# EAGLE design OpenBook (EAGLE 9.7.0)
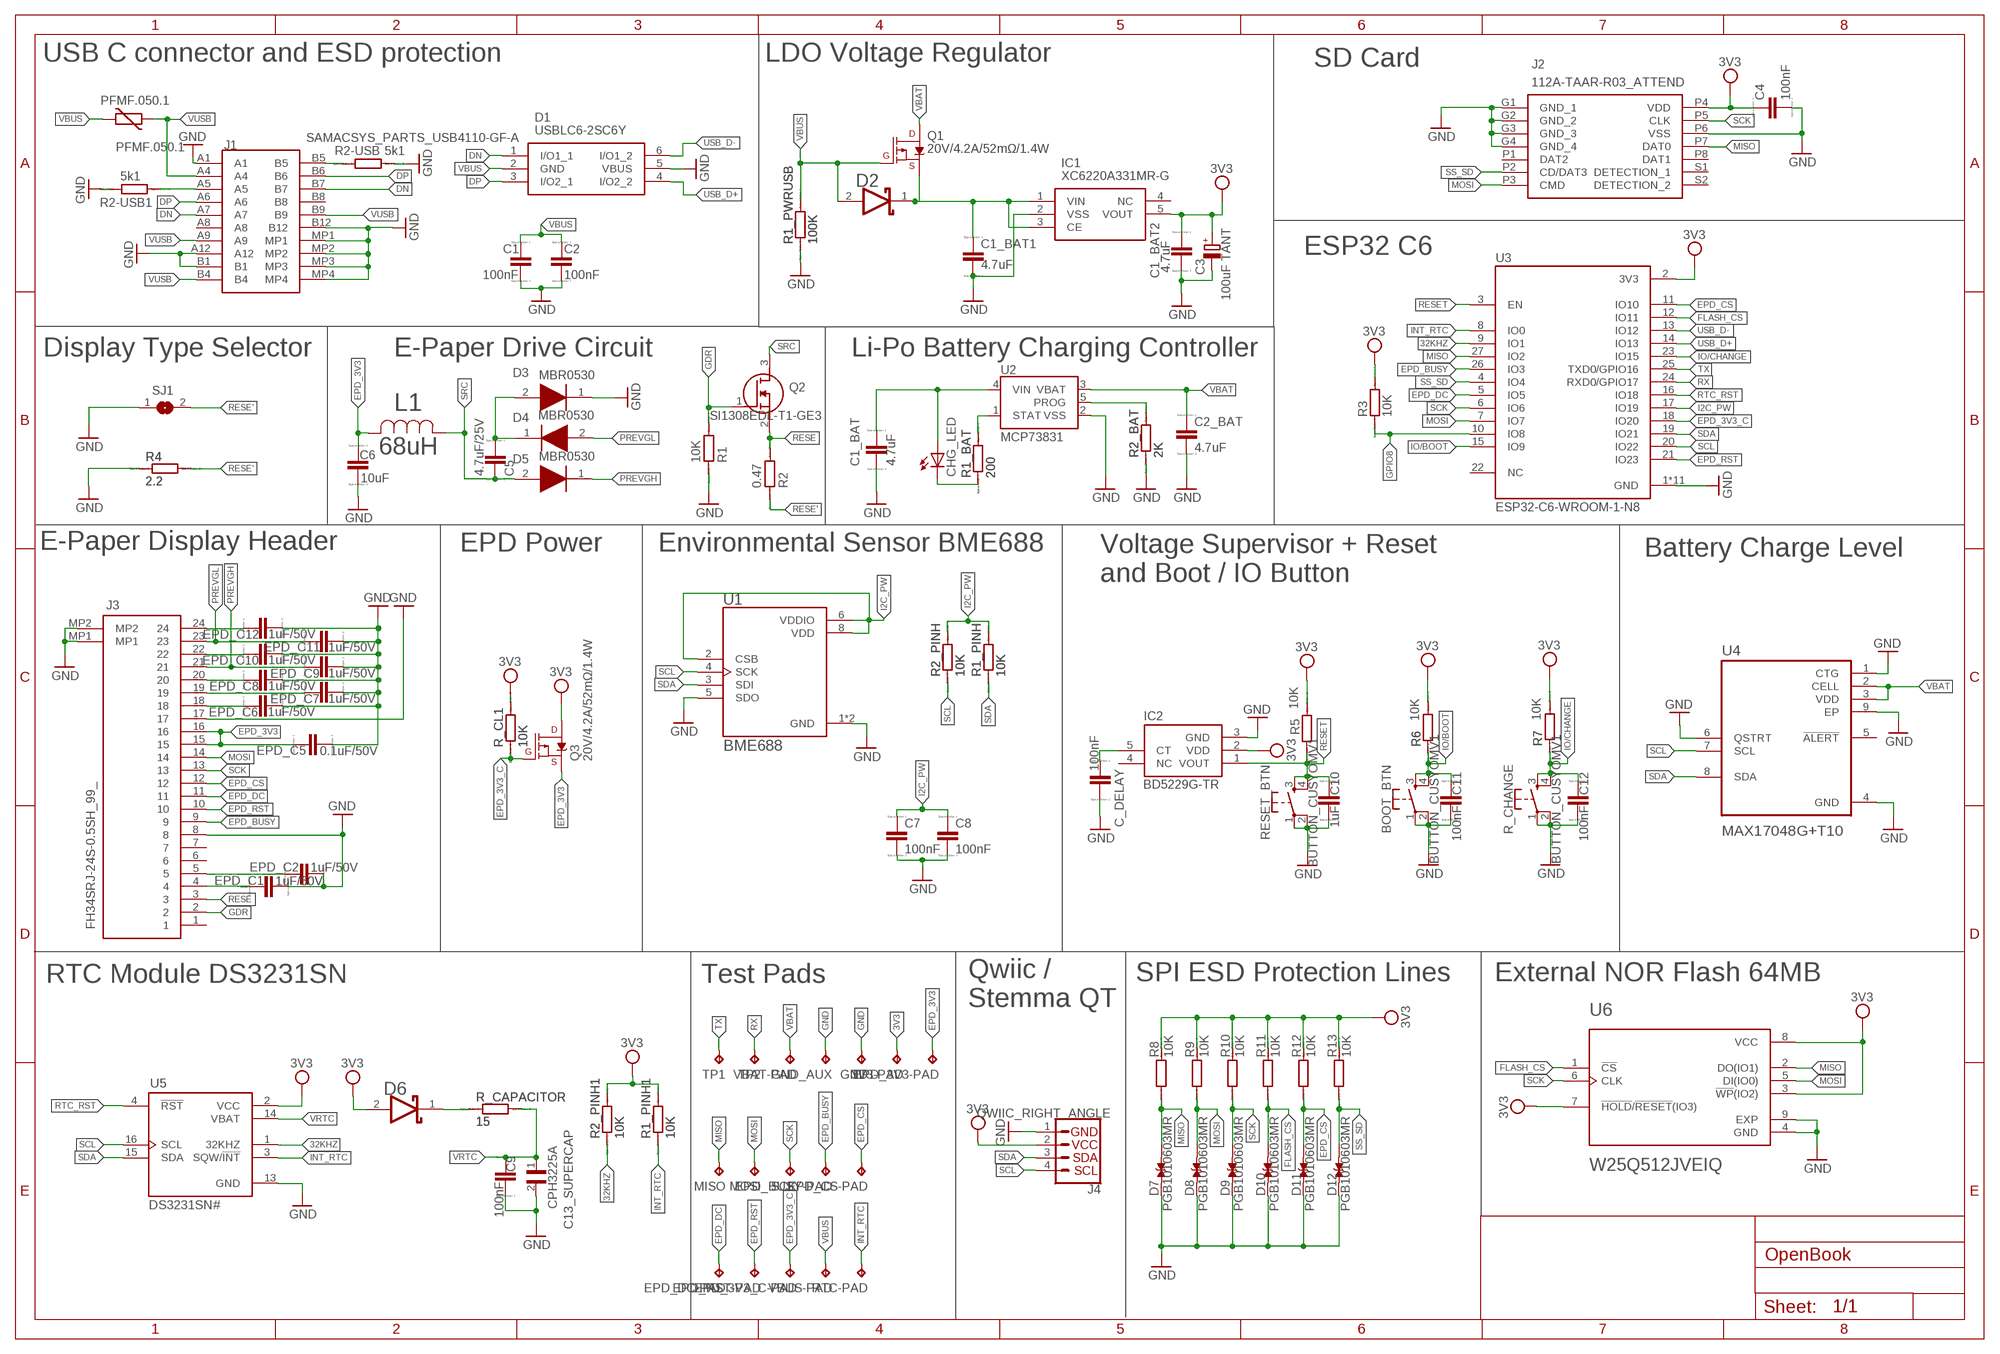
[diagram p0: schematic, sheet 1]

## Parts
3V3-PAD  TPTP20R  [TP20R]
BOOT_BTN  BUTTON_CUSYOMV1  [MYBUTTON]
C1  100nF  ESP32_WROVER_EAGLE-LTSPICE_CC0402  [ESP32_WROVER_EAGLE-LTSPICE_C0402]
C1_BAT  4.7uF  EAGLE-LTSPICE_CC0402  [EAGLE-LTSPICE_C0402]
C1_BAT1  4.7uF  EAGLE-LTSPICE_CC0402  [EAGLE-LTSPICE_C0402]
C1_BAT2  4.7uF  EAGLE-LTSPICE_CC0402  [EAGLE-LTSPICE_C0402]
C2  100nF  ESP32_WROVER_EAGLE-LTSPICE_CC0402  [ESP32_WROVER_EAGLE-LTSPICE_C0402]
C2_BAT  4.7uF  EAGLE-LTSPICE_CC0402  [EAGLE-LTSPICE_C0402]
C3  100uF TANT  RCL_CPOL-EUCT3528  [RCL_CT3528]
C4  100nF  EAGLE-LTSPICE_CC0402  [EAGLE-LTSPICE_C0402]
C5  4.7uF/25V  ESP32_WROVER_EAGLE-LTSPICE_CC0402  [ESP32_WROVER_EAGLE-LTSPICE_C0402]
C6  10uF  ESP32_WROVER_EAGLE-LTSPICE_CC0402  [ESP32_WROVER_EAGLE-LTSPICE_C0402]
C7  100nF  EAGLE-LTSPICE_CC0402  [EAGLE-LTSPICE_C0402]
C8  100nF  EAGLE-LTSPICE_CC0402  [EAGLE-LTSPICE_C0402]
C9  100nF  EAGLE-LTSPICE_CC0402  [EAGLE-LTSPICE_C0402]
C10  1uF  EAGLE-LTSPICE_CC0402  [EAGLE-LTSPICE_C0402]
C11  100nF  EAGLE-LTSPICE_CC0402  [EAGLE-LTSPICE_C0402]
C12  100nF  EAGLE-LTSPICE_CC0402  [EAGLE-LTSPICE_C0402]
C13_SUPERCAP  CPH3225A  [CAPCP3225X100N]
C_DELAY  100nF  EAGLE-LTSPICE_CC0402  [EAGLE-LTSPICE_C0402]
CHG_LED  ADAFRUIT_LEDCHIP-LED0603  [ADAFRUIT_CHIP-LED0603]
D1  USBLC6-2SC6Y  [SOT95P280X145-6N]
D2  ESP32_WROVER_AVX---SD0805S020S1R0_AVX_SD0805S020S1R0_0_0AVX_SD0805S020S1R0_0_0  [ESP32_WROVER_AVX---SD0805S020S1R0_AVX_SD0805S020S1R0_0]
D3  MBR0530  [SOD3716X135N]
D4  MBR0530  [SOD3716X135N]
D5  MBR0530  [SOD3716X135N]
D6  ESP32_WROVER_AVX---SD0805S020S1R0_AVX_SD0805S020S1R0_0_0AVX_SD0805S020S1R0_0_0  [ESP32_WROVER_AVX---SD0805S020S1R0_AVX_SD0805S020S1R0_0]
D7  PGB1010603MR  [DIOC1608X36N]
D8  PGB1010603MR  [DIOC1608X36N]
D9  PGB1010603MR  [DIOC1608X36N]
D10  PGB1010603MR  [DIOC1608X36N]
D11  PGB1010603MR  [DIOC1608X36N]
D12  PGB1010603MR  [DIOC1608X36N]
EPD_3V3-PAD  TPTP20R  [TP20R]
EPD_3V3_C-PAD  TPTP20R  [TP20R]
EPD_BUSY-PAD  TPTP20R  [TP20R]
EPD_C1  1uF/50V  ESP32_WROVER_EAGLE-LTSPICE_CC0402  [ESP32_WROVER_EAGLE-LTSPICE_C0402]
EPD_C2  1uF/50V  ESP32_WROVER_EAGLE-LTSPICE_CC0402  [ESP32_WROVER_EAGLE-LTSPICE_C0402]
EPD_C5  0.1uF/50V  ESP32_WROVER_EAGLE-LTSPICE_CC0402  [ESP32_WROVER_EAGLE-LTSPICE_C0402]
EPD_C6  1uF/50V  ESP32_WROVER_EAGLE-LTSPICE_CC0402  [ESP32_WROVER_EAGLE-LTSPICE_C0402]
EPD_C7  1uF/50V  ESP32_WROVER_EAGLE-LTSPICE_CC0402  [ESP32_WROVER_EAGLE-LTSPICE_C0402]
EPD_C8  1uF/50V  ESP32_WROVER_EAGLE-LTSPICE_CC0402  [ESP32_WROVER_EAGLE-LTSPICE_C0402]
EPD_C9  1uF/50V  ESP32_WROVER_EAGLE-LTSPICE_CC0402  [ESP32_WROVER_EAGLE-LTSPICE_C0402]
EPD_C10  1uF/50V  ESP32_WROVER_EAGLE-LTSPICE_CC0402  [ESP32_WROVER_EAGLE-LTSPICE_C0402]
EPD_C11  1uF/50V  ESP32_WROVER_EAGLE-LTSPICE_CC0402  [ESP32_WROVER_EAGLE-LTSPICE_C0402]
EPD_C12  1uF/50V  ESP32_WROVER_EAGLE-LTSPICE_CC0402  [ESP32_WROVER_EAGLE-LTSPICE_C0402]
EPD_CS-PAD  TPTP20R  [TP20R]
EPD_DC-PAD  TPTP20R  [TP20R]
EPD_RST-PAD  TPTP20R  [TP20R]
GND  TPTP20R  [TP20R]
GND_AUX  TPTP20R  [TP20R]
IC1  XC6220A331MR-G  [SOT95P280X120-5N]
IC2  BD5229G-TR  [SOT95P280X125-5N]
J1  SAMACSYS_PARTS_USB4110-GF-A  [SAMACSYS_PARTS_USB4110GFA]
J2  112A-TAAR-R03_ATTEND  [112ATAARR03ATTEND]
J3  FH34SRJ-24S-0.5SH_99_  [FH34SRJ24S05SH99]
J4  QWIIC_RIGHT_ANGLE  QWIIC_CONNECTORJS-1MM  [JST04_1MM_RA]
L1  68uH  744043680IND_4828-WE-TPC_WRE  [IND_4828-WE-TPC_WRE]
MISO  TPTP20R  [TP20R]
MOSI  TPTP20R  [TP20R]
PFMF.050.1  PFMF.050.1  ESP32C6_VARISTORCN1812  [ESP32C6_VARISTOR_CT/CN1812]
Q1  20V/4.2A/52mΩ/1.4W  ESP32_WROVER_SPARKFUN-DISCRETESEMI_MOSFET_PCH-DMG2305UX-7  [ESP32_WROVER_SPARKFUN-DISCRETESEMI_SOT23-3]
Q2  SI1308EDL-T1-GE3  [SOT65P210X110-3N]
Q3  20V/4.2A/52mΩ/1.4W  ESP32_WROVER_SPARKFUN-DISCRETESEMI_MOSFET_PCH-DMG2305UX-7  [ESP32_WROVER_SPARKFUN-DISCRETESEMI_SOT23-3]
R1  10K  ESP32_WROVER_EAGLE-LTSPICE_RR0402  [ESP32_WROVER_EAGLE-LTSPICE_R0402]
R1_BAT  200  ESP32_WROVER_EAGLE-LTSPICE_RR0402  [ESP32_WROVER_EAGLE-LTSPICE_R0402]
R1_PINH  10K  ESP32_WROVER_EAGLE-LTSPICE_RR0402  [ESP32_WROVER_EAGLE-LTSPICE_R0402]
R1_PINH1  10K  ESP32_WROVER_EAGLE-LTSPICE_RR0402  [ESP32_WROVER_EAGLE-LTSPICE_R0402]
R1_PWRUSB  100K  ESP32_WROVER_EAGLE-LTSPICE_RR0402  [ESP32_WROVER_EAGLE-LTSPICE_R0402]
R2  0.47  ESP32_WROVER_EAGLE-LTSPICE_RR0402  [ESP32_WROVER_EAGLE-LTSPICE_R0402]
R2-USB  5k1  ESP32_WROVER_EAGLE-LTSPICE_RR0402  [ESP32_WROVER_EAGLE-LTSPICE_R0402]
R2-USB1  5k1  ESP32_WROVER_EAGLE-LTSPICE_RR0402  [ESP32_WROVER_EAGLE-LTSPICE_R0402]
R2_BAT  2K  ESP32_WROVER_EAGLE-LTSPICE_RR0402  [ESP32_WROVER_EAGLE-LTSPICE_R0402]
R2_PINH  10K  ESP32_WROVER_EAGLE-LTSPICE_RR0402  [ESP32_WROVER_EAGLE-LTSPICE_R0402]
R2_PINH1  10K  ESP32_WROVER_EAGLE-LTSPICE_RR0402  [ESP32_WROVER_EAGLE-LTSPICE_R0402]
R3  10K  ESP32_WROVER_EAGLE-LTSPICE_RR0402  [ESP32_WROVER_EAGLE-LTSPICE_R0402]
R4  2.2  ESP32_WROVER_EAGLE-LTSPICE_RR0402  [ESP32_WROVER_EAGLE-LTSPICE_R0402]
R5  10K  ESP32_WROVER_EAGLE-LTSPICE_RR0402  [ESP32_WROVER_EAGLE-LTSPICE_R0402]
R6  10K  ESP32_WROVER_EAGLE-LTSPICE_RR0402  [ESP32_WROVER_EAGLE-LTSPICE_R0402]
R7  10K  ESP32_WROVER_EAGLE-LTSPICE_RR0402  [ESP32_WROVER_EAGLE-LTSPICE_R0402]
R8  10K  ESP32_WROVER_EAGLE-LTSPICE_RR0402  [ESP32_WROVER_EAGLE-LTSPICE_R0402]
R9  10K  ESP32_WROVER_EAGLE-LTSPICE_RR0402  [ESP32_WROVER_EAGLE-LTSPICE_R0402]
R10  10K  ESP32_WROVER_EAGLE-LTSPICE_RR0402  [ESP32_WROVER_EAGLE-LTSPICE_R0402]
R11  10K  ESP32_WROVER_EAGLE-LTSPICE_RR0402  [ESP32_WROVER_EAGLE-LTSPICE_R0402]
R12  10K  ESP32_WROVER_EAGLE-LTSPICE_RR0402  [ESP32_WROVER_EAGLE-LTSPICE_R0402]
R13  10K  ESP32_WROVER_EAGLE-LTSPICE_RR0402  [ESP32_WROVER_EAGLE-LTSPICE_R0402]
R_CAPACITOR  15  ESP32_WROVER_EAGLE-LTSPICE_RR0402  [ESP32_WROVER_EAGLE-LTSPICE_R0402]
R_CHANGE  BUTTON_CUSYOMV1  [MYBUTTON]
R_CL1  10K  ESP32_WROVER_EAGLE-LTSPICE_RR0402  [ESP32_WROVER_EAGLE-LTSPICE_R0402]
RESET_BTN  BUTTON_CUSYOMV1  [MYBUTTON]
RTC-PAD  TPTP20R  [TP20R]
SCK  TPTP20R  [TP20R]
SJ1  SJ  [SJ]
TP1  TPTP20R  [TP20R]
TP2  TPTP20R  [TP20R]
U1  BME688  ESP32_WROVER_BME680_BME680  [ESP32_WROVER_BME680_PSON80P300X300X100-8N]
U2  MCP73831  ESP32_WROVER_SPARKFUN-IC-POWER_MCP73831  [ESP32_WROVER_SPARKFUN-IC-POWER_SOT23-5]
U3  ESP32-C6-WROOM-1-N8  [XCVR_ESP32-C6-WROOM-1-N8]
U4  MAX17048G+T10  [SON50P200X200X80-9N]
U5  DS3231SN#  [SOIC127P1032X265-16N]
U6  W25Q512JVEIQ  [SON127P600X800X80-9N]
VBAT-PAD  TPTP20R  [TP20R]
VBUS-PAD  TPTP20R  [TP20R]

## Nets
3V3: 3V3-PAD.TP C1_BAT2.1 C3.+ C4.1 D6.2(ANODE) IC1.5(VOUT) IC2.2(VDD) J2.P4(VDD) J4.2 Q3.3(D) R1_PINH1.2 R2_PINH1.2 R3.2 R5.2 R6.2 R7.2 R8.2 R9.2 R10.2 R11.2 R12.2 R13.2 R_CL1.2 U3.2(3V3) U5.2(VCC) U6.3(!WP!(IO2)) U6.7(!HOLD!/!RESET!(IO3)) U6.8(VCC)
32KHZ: R2_PINH1.1 U3.9(IO1) U5.1(32KHZ)
DN: D1.1(I/O1_1) J1.A7 J1.B7
DP: D1.3(I/O2_1) J1.A6 J1.B6
EPD_3V3: C6.1 EPD_3V3-PAD.TP EPD_C5.1 J3.15 J3.16 L1.2 Q3.2(S)
EPD_3V3_C: EPD_3V3_C-PAD.TP Q3.1(G) R_CL1.1 U3.18(IO20)
EPD_BUSY: EPD_BUSY-PAD.TP J3.9 U3.26(IO3)
EPD_CS: D11.2 EPD_CS-PAD.TP J3.12 R12.1 U3.11(IO10)
EPD_DC: EPD_DC-PAD.TP J3.11 U3.5(IO5)
EPD_RST: EPD_RST-PAD.TP J3.10 U3.21(IO23)
FLASH_CS: D10.2 R11.1 U3.12(IO11) U6.1(!CS)
GDR: J3.2 Q2.1(G) R1.2
GND: BOOT_BTN.1 BOOT_BTN.2 C1.2 C1_BAT1.2 C1_BAT2.2 C1_BAT.2 C2.2 C2_BAT.2 C3.- C4.2 C6.2 C7.2 C8.2 C9.2 C10.2 C11.2 C12.2 C13_SUPERCAP.2 C_DELAY.2 D1.5(VBUS) D3.1(K) D7.1 D8.1 D9.1 D10.1 D11.1 D12.1 EPD_C1.1 EPD_C2.1 EPD_C5.2 EPD_C6.2 EPD_C7.2 EPD_C8.2 EPD_C9.2 EPD_C10.2 EPD_C11.2 EPD_C12.2 GND.TP GND_AUX.TP IC1.2(VSS) IC2.3(GND) J1.A1 J1.A12 J1.B1 J1.B12 J1.MP1 J1.MP2 J1.MP3 J1.MP4 J2.G1(GND_1) J2.G2(GND_2) J2.G3(GND_3) J2.G4(GND_4) J2.P6(VSS) J3.8 J3.17 J3.MP1 J3.MP2 J4.1 R1.1 R1_PWRUSB.1 R2-USB1.1 R2-USB.2 R2_BAT.1 R4.1 R_CHANGE.1 R_CHANGE.2 RESET_BTN.1 RESET_BTN.2 SJ1.1 U1.1(GND) U1.5(SDO) U1.7(GND) U2.2(VSS) U3.1(GND) U3.28(GND) U3.29_1(GND) U3.29_2(GND) U3.29_3(GND) U3.29_4(GND) U3.29_5(GND) U3.29_6(GND) U3.29_7(GND) U3.29_8(GND) U3.29_9(GND) U4.1(CTG) U4.4(GND) U4.6(QSTRT) U4.9(EP) U5.13(GND) U6.4(GND) U6.9(EXP)
GPIO8: R3.1 U3.10(IO8)
I2C_PW: C7.1 C8.1 R1_PINH.2 R2_PINH.2 U1.2(CSB) U1.6(VDDIO) U1.8(VDD) U3.17(IO19)
INT_RTC: R1_PINH1.1 RTC-PAD.TP U3.8(IO0) U5.3(SQW/!INT)
IO/BOOT: BOOT_BTN.3 BOOT_BTN.4 C11.1 R6.1 U3.15(IO9)
IO/CHANGE: C12.1 R7.1 R_CHANGE.3 R_CHANGE.4 U3.23(IO15)
MISO: D7.2 J2.P7(DAT0) MISO.TP R8.1 U3.27(IO2) U6.2(DO(IO1))
MOSI: D8.2 J2.P3(CMD) J3.14 MOSI.TP R9.1 U3.7(IO7) U6.5(DI(IO0))
N$1: J1.A5 R2-USB1.2
N$2: J1.B5 R2-USB.1
N$3: C1_BAT1.1 D2.1(CATHODE) IC1.1(VIN) IC1.3(CE) Q1.2(S)
N$4: C5.1 D3.2(A) D4.1(K)
N$5: EPD_C1.2 J3.4
N$6: EPD_C2.2 J3.5
N$7: EPD_C6.1 J3.18
N$8: EPD_C7.1 J3.19
N$9: EPD_C8.1 J3.20
N$10: R2_BAT.2 U2.5(PROG)
N$11: EPD_C10.1 J3.22
N$12: R1_BAT.2 U2.1(STAT)
N$13: EPD_C12.1 J3.24
N$14: CHG_LED.C R1_BAT.1
N$15: C1_BAT.1 CHG_LED.A U2.4(VIN)
N$16: C_DELAY.1 IC2.5(CT)
N$17: D6.1(CATHODE) R_CAPACITOR.1
PREVGH: D5.1(K) EPD_C9.1 J3.21
PREVGL: D4.2(A) EPD_C11.1 J3.23
RESE: J3.3 Q2.2(S) R2.2
RESE': R2.1 R4.2 SJ1.2
RESET: C10.1 IC2.1(VOUT) R5.1 RESET_BTN.3 RESET_BTN.4 U3.3(EN)
RTC_RST: U3.16(IO18) U5.4(!RST)
RX: TP2.TP U3.24(RXD0/GPIO17)
SCK: D9.2 J2.P5(CLK) J3.13 R10.1 SCK.TP U3.6(IO6) U6.6(CLK)
SCL: J4.4 R2_PINH.1 U1.4(SCK) U3.20(IO22) U4.7(SCL) U5.16(SCL)
SDA: J4.3 R1_PINH.1 U1.3(SDI) U3.19(IO21) U4.8(SDA) U5.15(SDA)
SRC: C5.2 D5.2(A) L1.1 Q2.3(D)
SS_SD: D12.2 J2.P2(CD/DAT3) R13.1 U3.4(IO4)
TX: TP1.TP U3.25(TXD0/GPIO16)
USB_D+: D1.4(I/O2_2) U3.14(IO13)
USB_D-: D1.6(I/O1_2) U3.13(IO12)
VBAT: C2_BAT.1 Q1.3(D) U2.3(VBAT) U4.2(CELL) U4.3(VDD) VBAT-PAD.TP
VBUS: C1.1 C2.1 D1.2(GND) D2.2(ANODE) PFMF.050.1.2 Q1.1(G) R1_PWRUSB.2 VBUS-PAD.TP
VRTC: C9.1 C13_SUPERCAP.1 R_CAPACITOR.2 U5.14(VBAT)
VUSB: J1.A4 J1.A9 J1.B4 J1.B9 PFMF.050.1.1
Unconnected: IC1.4(NC) IC2.4(NC) J1.A8 J1.B8 J2.P1(DAT2) J2.P8(DAT1) J2.S1(DETECTION_1) J2.S2(DETECTION_2) J3.1 J3.6 J3.7 U3.22(NC) U4.5(!ALERT)

## Notes on the sheet
- USB C connector and ESD protection | LDO Voltage Regulator | SD Card
- ESP32 C6
- Display Type Selector | E-Paper Drive Circuit | Li-Po Battery Charging Controller
- E-Paper Display Header | EPD Power | Environmental Sensor BME688 | Battery Charge Level
- Voltage Supervisor + Reset
  and Boot / IO Button
- RTC Module DS3231SN | Test Pads | SPI ESD Protection Lines | External NOR Flash 64MB
- Qwiic /
  Stemma QT

## Library data of the parts
3V3-PAD EPD_3V3-PAD EPD_3V3_C-PAD EPD_BUSY-PAD EPD_CS-PAD EPD_DC-PAD EPD_RST-PAD GND GND_AUX MISO MOSI RTC-PAD SCK TP1 TP2 VBAT-PAD VBUS-PAD = DeskAssistant v19 v1:TP: Test pad
BOOT_BTN R_CHANGE RESET_BTN = DeskAssistant v19 v1:BUTTON_CUSYOMV1
C1 C2 C5 C6 EPD_C1 EPD_C2 EPD_C5-EPD_C12 = DeskAssistant v19 v1:ESP32_WROVER_EAGLE-LTSPICE_C: CAPACITOR, European symbol; SPICEMODEL: NONE; SPICEPREFIX: C
C1_BAT C1_BAT1 C1_BAT2 C2_BAT C4 C7-C12 C_DELAY = DeskAssistant v19 v1:EAGLE-LTSPICE_C: CAPACITOR, European symbol; SPICEMODEL: NONE; SPICEPREFIX: C
C3 = DeskAssistant v19 v1:RCL_CPOL-EU: POLARIZED CAPACITOR, European symbol; SPICEPREFIX: C
C13_SUPERCAP = DeskAssistant v19 v1:CPH3225A: Cap 0.011F 3.3V 1210 Flat Check availability <https://pricing.snapeda.com/parts/CPH3225A/Seiko%20Instruments/view-part?ref=eda>; AVAILABILITY: Not in stock; CHECK_PRICES: https://www.snapeda.com/parts/CPH3225A/Seiko+Instruments/view-part/?ref=eda; DESCRIPTION: 11 mF (EDLC) Supercapacitor 3.3 V 1210 (3225 Metric) - -; MF: Seiko Instruments; MP: CPH3225A; PACKAGE: 1210 Seiko; PRICE: None; PURCHASE-URL: https://www.snapeda.com/api/url_track_click_mouser/?unipart_id=562593&manufacturer=Seiko Instruments&part_name=CPH3225A&search_term=None; SNAPEDA_LINK: https://www.snapeda.com/parts/CPH3225A/Seiko+Instruments/view-part/?ref=snap
CHG_LED = DeskAssistant v19 v1:ADAFRUIT_LED: LED OSRAM: - CHIPLED LG R971, LG N971, LY N971, LG Q971, LY Q971, LO R971, LY R971 LH N974, LH R974 LS Q976, LO Q976, LY Q976 LO Q996 - Hyper CHIPLED LW Q18S LB Q993, LB Q99A, LB R99A - SideLED LS A670, LO A670, LY A670, LG A670, LP A670 LB A673, LV A673, LT A673, LW A673 LH A674 LY A675 LS A676, LA A676, LO A676, LY A676, LW A676 LS A679, LY A679, LG A679 - Hyper Micro SIDELED® LS Y876, LA Y876, LO Y876, LY Y876 LT Y87S - SmartLED LW L88C, LW L88S LB L89C, LB L89S, LG L890 LS L89K, LO L89K, LY L89K LS L896, LA L896, LO L896, LY L896 - TOPLED LS T670, LO T670, LY T670, LG T670, LP T670 LSG T670, LSP T670, LSY T670, LOP T670, LYG T670 LG T671, LOG T671, LSG T671 LB T673, LV T673, LT T673, LW T673 LH T674 LS T676, LA T676, LO T676, LY T676, LB T676, LH T676, LSB T676, LW T676 LB T67C, LV T67C, LT T67C, LS T67K, LO T67K, LY T67K, LW E67C LS E67B, LA E67B, LO E67B, LY E67B, LB E67C, LV E67C, LT E67C LW T67C LS T679, LY T679, LG T679 LS T770, LO T770, LY T770, LG T770, LP T770 LB T773, LV T773, LT T773, LW T773 LH T774 LS E675, LA E675, LY E675, LS T675 LS T776, LA T776, LO T776, LY T776, LB T776 LHGB T686 LT T68C, LB T68C - Hyper Mini TOPLED® LB M676 - Mini TOPLED Santana® LG M470 LS M47K, LO M47K, LY M47K Source: http://www.osram.convergy.de/
D1 = DeskAssistant v19 v1:USBLC6-2SC6Y: Low Cap. ESD Protection Auto SOT-23-6 STMicroelectronics USBLC6-2SC6Y, Dual Uni-Directional TVS Diode Array, 6-Pin SOT-23 Source: Datasheet <https://componentsearchengine.com/Datasheets/1/USBLC6-2SC6Y.pdf> Check availability <https://pricing.snapeda.com/parts/USBLC6-2SC6Y/STMicroelectronics/view-part?ref=eda>; AVAILABILITY: In Stock; CHECK_PRICES: https://www.snapeda.com/parts/USBLC6-2SC6Y/STMicroelectronics/view-part/?ref=eda; DESCRIPTION: 17V Clamp 5A (8/20µs) Ipp Tvs Diode Surface Mount SOT-23-6; MF: STMicroelectronics; MP: USBLC6-2SC6Y; PACKAGE: SOT-23-6 STMicroelectronics; PRICE: None; SNAPEDA_LINK: https://www.snapeda.com/parts/USBLC6-2SC6Y/STMicroelectronics/view-part/?ref=snap
D2 D6 = DeskAssistant v19 v1:ESP32_WROVER_AVX---SD0805S020S1R0_AVX_SD0805S020S1R0_0_0: Schottky Barrier Rectifier Diode; CENTROID_NOT_SPECIFIED: No; DATASHEET: http://datasheets.avx.com/schottky.pdf; DIGIKEY_DESCRIPTION: DIODE SCHOTTKY 20V 1A 0805; DIGIKEY_PART_NUMBER: 478-7800-1-ND; LEAD_FREE: yes; MF: AVX; MOUSER_PART_NUMBER: 581-SD0805S020S1R0; PACKAGE: 0805 (2012 metric); PREFIX: D; ROHS: yes; TEMPERATURE_RANGE_HIGH: +125°C; TEMPERATURE_RANGE_LOW: -55°C
D3-D5 = DeskAssistant v19 v1:MBR0530: ON SEMICONDUCTOR - MBR0530 - DIODE, SCHOTTKY, 0.5A, 30V, SOD-123 Source: Datasheet <http://www.onsemi.com/pub/Collateral/MBR0530T1-D.PDF> Check availability <https://pricing.snapeda.com/parts/MBR0530/ON%20Semiconductor/view-part?ref=eda>; AVAILABILITY: In Stock; CHECK_PRICES: https://www.snapeda.com/parts/MBR0530/Onsemi/view-part/?ref=eda; DESCRIPTION: Diode Schottky 30 V 500mA Surface Mount SOD-123; MF: ON Semiconductor; MP: MBR0530; PACKAGE: SOD-123-2 ON Semiconductor; PRICE: None; PURCHASE-URL: https://www.snapeda.com/api/url_track_click_mouser/?unipart_id=179458&manufacturer=ON Semiconductor&part_name=MBR0530&search_term=None; SNAPEDA_LINK: https://www.snapeda.com/parts/MBR0530/Onsemi/view-part/?ref=snap
D7-D12 = DeskAssistant v19 v1:PGB1010603MR: Check availability <https://pricing.snapeda.com/parts/PGB1010603MR/Littelfuse%20Inc./view-part?ref=eda>; AVAILABILITY: In Stock; CHECK_PRICES: https://www.snapeda.com/parts/PGB1010603MR/Littelfuse/view-part/?ref=eda; DESCRIPTION: 150V (Typ) Clamp - Ipp Tvs Diode Surface Mount 0603 (1608 Metric); MF: Littelfuse Inc.; MP: PGB1010603MR; PACKAGE: 0603 Littelfuse Inc.; PRICE: None; PURCHASE-URL: https://www.snapeda.com/api/url_track_click_mouser/?unipart_id=5659453&manufacturer=Littelfuse Inc.&part_name=PGB1010603MR&search_term=None; SNAPEDA_LINK: https://www.snapeda.com/parts/PGB1010603MR/Littelfuse/view-part/?ref=snap
IC1 = DeskAssistant v19 v1:XC6220A331MR-G: LDO Voltage Regulators Source: Datasheet <https://www.torexsemi.com/file/xc6220/XC6220.pdf>; DESCRIPTION: LDO Voltage Regulators; HEIGHT: 1.2mm; MANUFACTURER_NAME: Torex; MANUFACTURER_PART_NUMBER: XC6220A331MR-G; MOUSER_PART_NUMBER: 865-XC6220A331MR-G; MOUSER_PRICE-STOCK: https://www.mouser.co.uk/ProductDetail/Torex-Semiconductor/XC6220A331MR-G?qs=AsjdqWjXhJ8ZSWznL1J0gg%3D%3D
IC2 = DeskAssistant v19 v1:BD5229G-TR: Voltage Detector with Adjustable Delay Time: CMOS processes are utilized to develop high precision, low current consumption CMOS reset ICs that allow arbitrary setting of the delay time. The extensive lineup includes both Nch Open Drain and CMOS output types in a wide range of detection voltages (from 2.3V to 6.0V, in 0.1V steps), enabling selection of the ideal solution based on customer requirements. In addition, the entire series is of course both lead-free and RoHS-compliant. Source: Datasheet <https://datasheet.datasheetarchive.com/originals/distributors/Datasheets_SAMA/f2b9741ef86007909f138d561a359946.pdf>; DESCRIPTION: Voltage Detector with Adjustable Delay Time: CMOS processes are utilized to develop high precision, low current consumption CMOS reset ICs that allow arbitrary setting of the delay time. The extensive lineup includes both Nch Open Drain and CMOS output types in a wide range of detection voltages (from 2.3V to 6.0V, in 0.1V steps), enabling selection of the ideal solution based on customer requirements. In addition, the entire series is of course both lead-free and RoHS-compliant.; HEIGHT: 1.25mm; MANUFACTURER_NAME: ROHM Semiconductor; MANUFACTURER_PART_NUMBER: BD5229G-TR; MOUSER_PART_NUMBER: 755-BD5229G-TR; MOUSER_PRICE-STOCK: https://www.mouser.co.uk/ProductDetail/ROHM-Semiconductor/BD5229G-TR?qs=4kLU8WoGk0vvnhrrYwdszw%3D%3D
J1 = DeskAssistant v19 v1:SAMACSYS_PARTS_USB4110-GF-A: CONN USB 2.0 TYPE-C R/A SMT Source: Datasheet <https://gct.co/files/drawings/usb4110.pdf>; DESCRIPTION: CONN USB 2.0 TYPE-C R/A SMT; HEIGHT: 3.26mm; MANUFACTURER_NAME: GCT (GLOBAL CONNECTOR TECHNOLOGY); MANUFACTURER_PART_NUMBER: USB4110-GF-A; MOUSER_PART_NUMBER: 640-USB4110-GF-A; MOUSER_PRICE-STOCK: https://www.mouser.co.uk/ProductDetail/GCT/USB4110-GF-A?qs=KUoIvG%2F9IlYiZvIXQjyJeA%3D%3D
J2 = DeskAssistant v19 v1:112A-TAAR-R03_ATTEND: Micro SD Card Socket, Push-Push Type, Top Mount, SMT, H=1.83mm, 10u Source: Datasheet <https://www.attend.com.tw/data/download/file/112A-TAAR-R03.pdf>; DESCRIPTION: Micro SD Card Socket, Push-Push Type, Top Mount, SMT, H=1.83mm, 10u; HEIGHT: 1.9mm; MANUFACTURER_NAME: ATTEND; MANUFACTURER_PART_NUMBER: 112A-TAAR-R03 ATTEND
J3 = DeskAssistant v19 v1:FH34SRJ-24S-0.5SH_99_: 24 Position FFC, FPC Connector Contacts, Top and Bottom 0.020" (0.50mm) Surface Mount, Right Angle Source: Datasheet <https://www.hirose.com/en/product/document?clcode=CL0580-1255-6-99&productname=FH34SRJ-24S-0.5SH(99)&series=FH34SRJ&documenttype=2DDrawing&lang=en&documentid=0000990903>; DESCRIPTION: 24 Position FFC, FPC Connector Contacts, Top and Bottom 0.020" (0.50mm) Surface Mount, Right Angle; HEIGHT: 1.1mm; MANUFACTURER_NAME: Hirose; MANUFACTURER_PART_NUMBER: FH34SRJ-24S-0.5SH(99); MOUSER_PART_NUMBER: 798-FH34SRJ24S05SH99; MOUSER_PRICE-STOCK: https://www.mouser.co.uk/ProductDetail/Hirose-Connector/FH34SRJ-24S-0.5SH99?qs=vcbW%252B4%252BSTIpKBl5ap9J8Fw%3D%3D
J4 = DeskAssistant v19 v1:QWIIC_CONNECTOR: SparkFun I2C Standard Qwiic Connector An SMD 1mm pitch JST connector makes it easy and quick (get it? Qwiic?) to connect I2C devices to each other. The Qwiic system <http://www.sparkfun.com/qwiic> enables fast and solderless connection between popular platforms and various sensors and actuators. We carry 200mm <https://www.sparkfun.com/products/14204>, 100mm <https://www.sparkfun.com/products/14205>, 50mm <https://www.sparkfun.com/products/14206>, and breadboard friendly <https://www.sparkfun.com/products/14207> Qwiic cables. We also offer 10 pcs strips <https://www.sparkfun.com/products/14323> the SMD connectors.; PROD_ID: CONN-13694
L1 = DeskAssistant v19 v1:744043680; COPYRIGHT: Copyright (C) 2024 Ultra Librarian. All rights reserved.; MANUFACTURER_PART_NUMBER: 744043680; MFR_NAME: Wurth Electronics
PFMF.050.1 = DeskAssistant v19 v1:ESP32C6_VARISTOR: VARISTOR
Q1 Q3 = DeskAssistant v19 v1:ESP32_WROVER_SPARKFUN-DISCRETESEMI_MOSFET_PCH: P-channel MOSFETs Voltage controlled devices that allow control of high current outputs. SparkFun Products: SparkFun ESP32 Thing <https://www.sparkfun.com/products/13907> SparkFun ESP8266 Thing <https://www.sparkfun.com/products/13231> SparkFun Pi Servo HAT V2 <https://www.sparkfun.com/products/15316> DMG2305UX-7 (20V/4.2A/SOT23-3); PROD_ID: TRAN-14388
Q2 = DeskAssistant v19 v1:SI1308EDL-T1-GE3: MOSFET N-Ch 30V 1.5A TrenchFET SC70 Vishay Si1308EDL-T1-GE3 N-channel MOSFET Transistor, 1.5 A, 30 V, 3-Pin SC-70 Source: Datasheet <https://componentsearchengine.com/Datasheets/1/SI1308EDL-T1-GE3.pdf> Check availability <https://pricing.snapeda.com/parts/SI1308EDL-T1-GE3/Vishay%20Siliconix/view-part?ref=eda>; AVAILABILITY: In Stock; CHECK_PRICES: https://www.snapeda.com/parts/SI1308EDL-T1-GE3/Vishay+Siliconix/view-part/?ref=eda; DESCRIPTION: Si1308EDL-T1-GE3 N-channel MOSFET Transistor, 1.5 A, 30 V, 3-Pin SC-70 | Siliconix / Vishay SI1308EDL-T1-GE3; MF: Vishay Siliconix; MP: SI1308EDL-T1-GE3; PACKAGE: SOT-323 Vishay Semiconductor; PRICE: None; PURCHASE-URL: https://www.snapeda.com/api/url_track_click_mouser/?unipart_id=274603&manufacturer=Vishay Siliconix&part_name=SI1308EDL-T1-GE3&search_term=None; SNAPEDA_LINK: https://www.snapeda.com/parts/SI1308EDL-T1-GE3/Vishay+Siliconix/view-part/?ref=snap
R1 R1_BAT R1_PINH R1_PINH1 R1_PWRUSB R2 R2-USB R2-USB1 R2_BAT R2_PINH R2_PINH1 R3-R13 R_CAPACITOR R_CL1 = DeskAssistant v19 v1:ESP32_WROVER_EAGLE-LTSPICE_R: RESISTOR, European symbol; SPICEMODEL: NONE; SPICEPREFIX: R
SJ1 = DeskAssistant v19 v1:SJ: SMD solder JUMPER
U1 = DeskAssistant v19 v1:ESP32_WROVER_BME680_BME680: Integrated Environmental Unit; AVAILABILITY: Unavailable; DESCRIPTION: Integrated Environmental Unit; MF: Bosch Sensortec; MP: BME680; PACKAGE: LGA-8 Bosch Tools; PRICE: None
U2 = DeskAssistant v19 v1:ESP32_WROVER_SPARKFUN-IC-POWER_MCP73831: MCP73831T Li-Ion, Li-Pol Controller Miniature single cell, fully integrated Li-Ion, Li-polymer charge management controller Datasheet <http://ww1.microchip.com/downloads/en/DeviceDoc/20001984g.pdf> SparkFun Products: SparkFun ESP32 Thing <https://www.sparkfun.com/products/13907> SparkFun 9DoF Razor IMU M0 <https://www.sparkfun.com/products/14001>; PROD_ID: IC-09995
U3 = DeskAssistant v19 v1:ESP32-C6-WROOM-1-N8: Check availability <https://pricing.snapeda.com/parts/ESP32-C6-WROOM-1-N8/Espressif%20Systems/view-part?ref=eda>; AVAILABILITY: In Stock; CHECK_PRICES: https://www.snapeda.com/parts/ESP32-C6-WROOM-1-N8/Espressif+Systems/view-part/?ref=eda; DESCRIPTION: Multiprotocol Modules ESP32-C6 module, Wi-Fi 6 in 2.4 GHz band, Bluetooth 5, Zigbee 3.0 and Thread. ESP34-WROOM Compatible - ENGINEERING SAMPLE; MF: Espressif Systems; MP: ESP32-C6-WROOM-1-N8; PACKAGE: None; PRICE: None; SNAPEDA_LINK: https://www.snapeda.com/parts/ESP32-C6-WROOM-1-N8/Espressif+Systems/view-part/?ref=snap
U4 = DeskAssistant v19 v1:MAX17048G+T10: Check availability <https://pricing.snapeda.com/parts/MAX17048G%2BT10/Analog%20Devices/view-part?ref=eda>; AVAILABILITY: In Stock; CHECK_PRICES: https://www.snapeda.com/parts/MAX17048G+T10/Analog+Devices/view-part/?ref=eda; DESCRIPTION: 3µA 1-Cell/2-Cell Fuel Gauge with ModelGauge; MF: Analog Devices; MP: MAX17048G+T10; PACKAGE: TDFN-8 Maxim; PRICE: None; PURCHASE-URL: https://www.snapeda.com/api/url_track_click_mouser/?unipart_id=329239&manufacturer=Analog Devices&part_name=MAX17048G+T10&search_term=None; SNAPEDA_LINK: https://www.snapeda.com/parts/MAX17048G+T10/Analog+Devices/view-part/?ref=snap
U5 = DeskAssistant v19 v1:DS3231SN#: Real Time Clock Serial 16-Pin SOIC W T/R Check availability <https://pricing.snapeda.com/parts/DS3231SN%23/Analog%20Devices/view-part?ref=eda>; AVAILABILITY: In Stock; CHECK_PRICES: https://www.snapeda.com/parts/DS3231SN%23/Analog+Devices/view-part/?ref=eda; DESCRIPTION: Extremely Accurate I²C-Integrated RTC/TCXO/Crystal; MF: Analog Devices; MP: DS3231SN#; PACKAGE: SOIC-16 Maxim; PRICE: None; PURCHASE-URL: https://www.snapeda.com/api/url_track_click_mouser/?unipart_id=99048&manufacturer=Analog Devices&part_name=DS3231SN#&search_term=None; SNAPEDA_LINK: https://www.snapeda.com/parts/DS3231SN%23/Analog+Devices/view-part/?ref=snap
U6 = DeskAssistant v19 v1:W25Q512JVEIQ: Check availability <https://pricing.snapeda.com/parts/W25Q512JVEIQ/Winbond%20Electronics/view-part?ref=eda>; AVAILABILITY: In Stock; CHECK_PRICES: https://www.snapeda.com/parts/W25Q512JVEIQ/Winbond+Electronics/view-part/?ref=eda; DESCRIPTION: FLASH - NOR Memory IC 512Mb (64M x 8) SPI - Quad I/O 133 MHz 8-WSON (8x6); MF: Winbond Electronics; MP: W25Q512JVEIQ; PACKAGE: Package; PRICE: None; SNAPEDA_LINK: https://www.snapeda.com/parts/W25Q512JVEIQ/Winbond+Electronics/view-part/?ref=snap

## Board
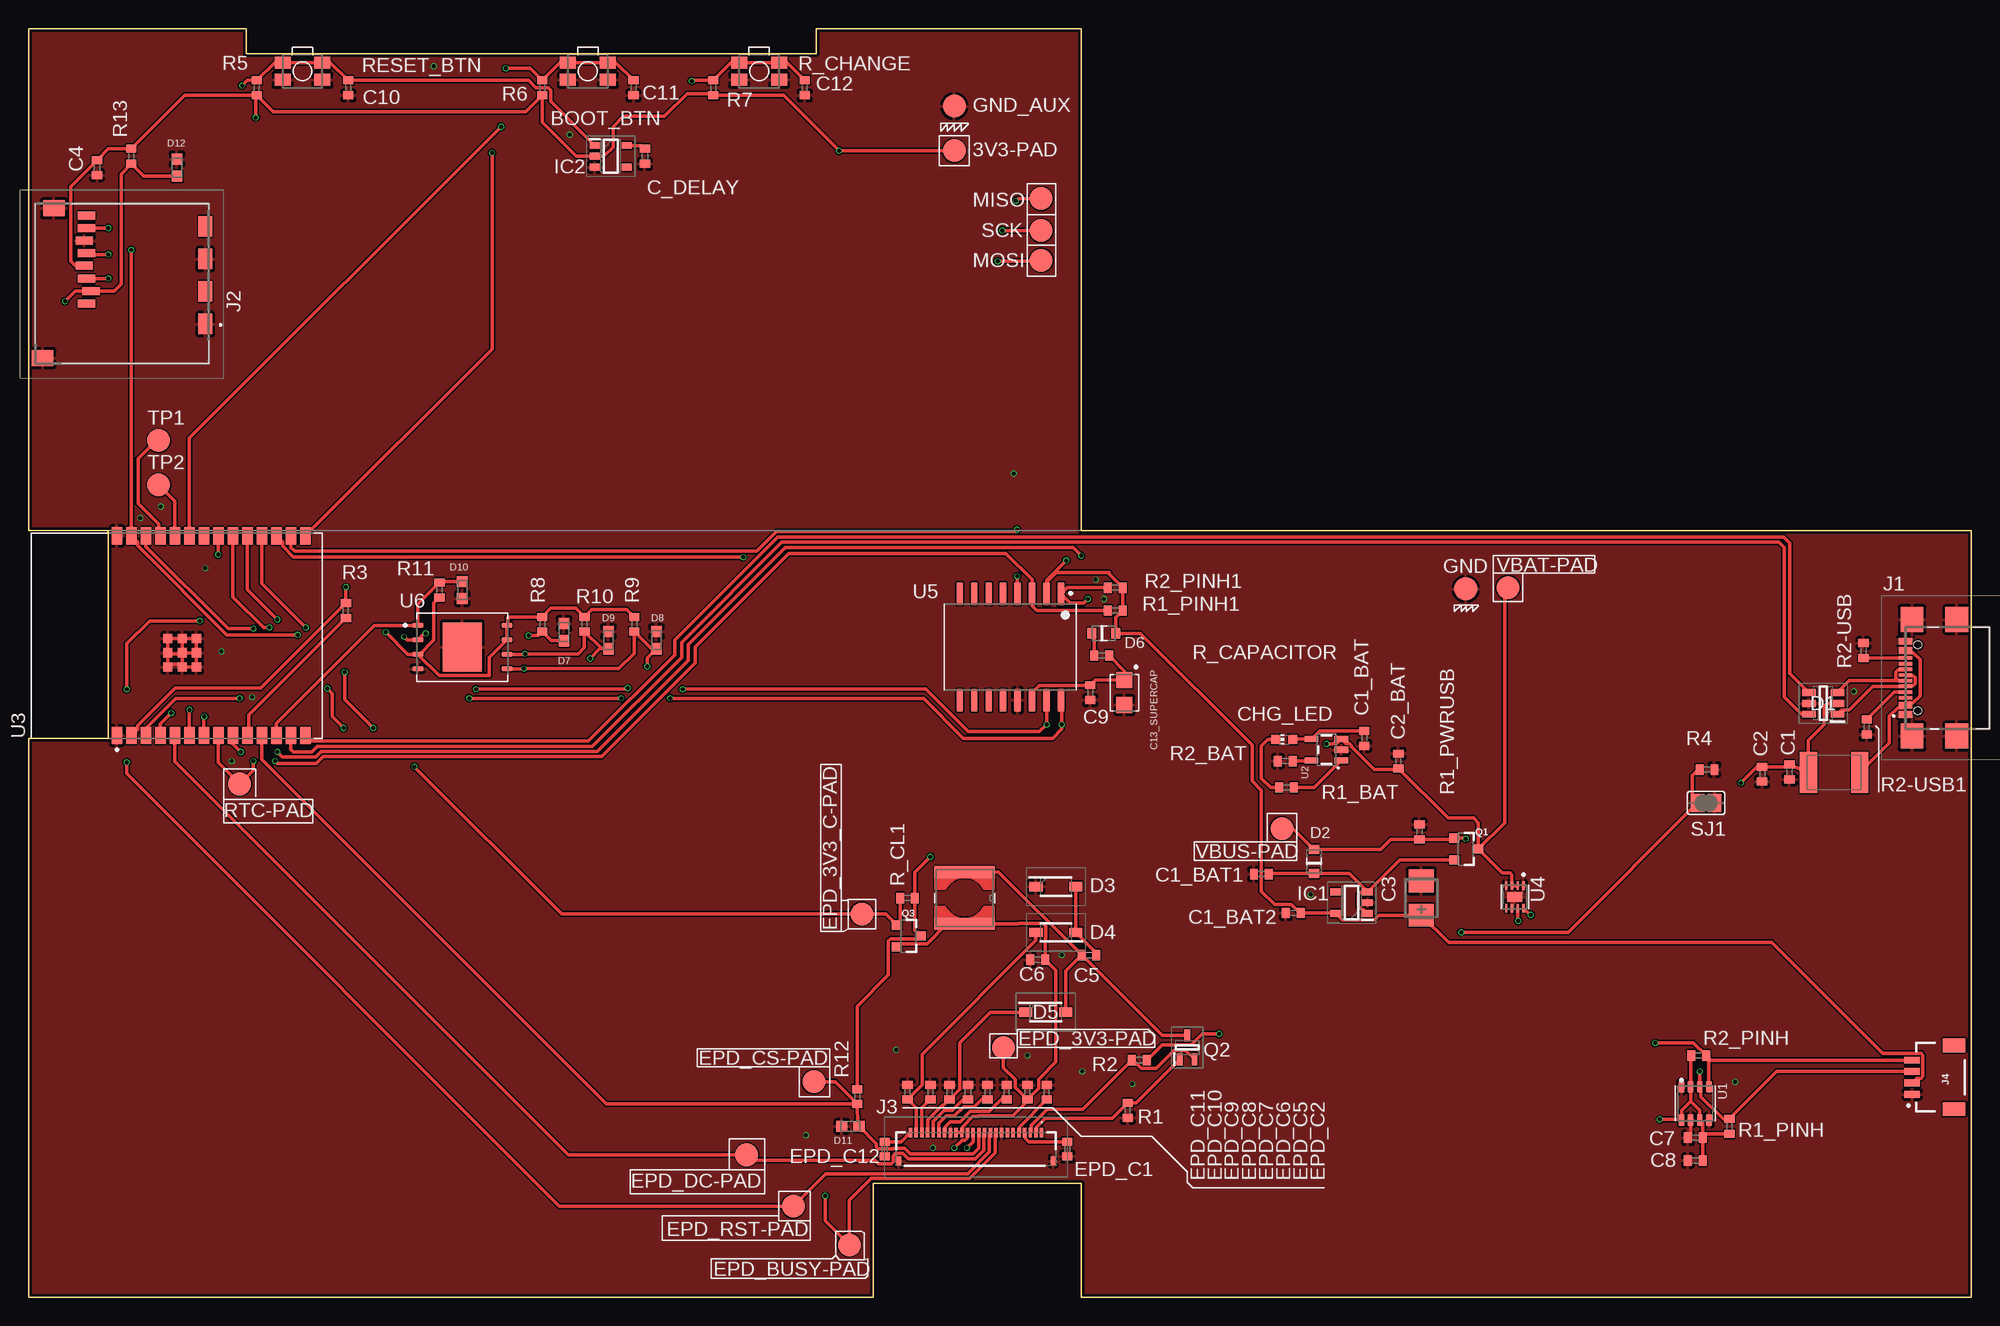
[diagram p1: board, top side]
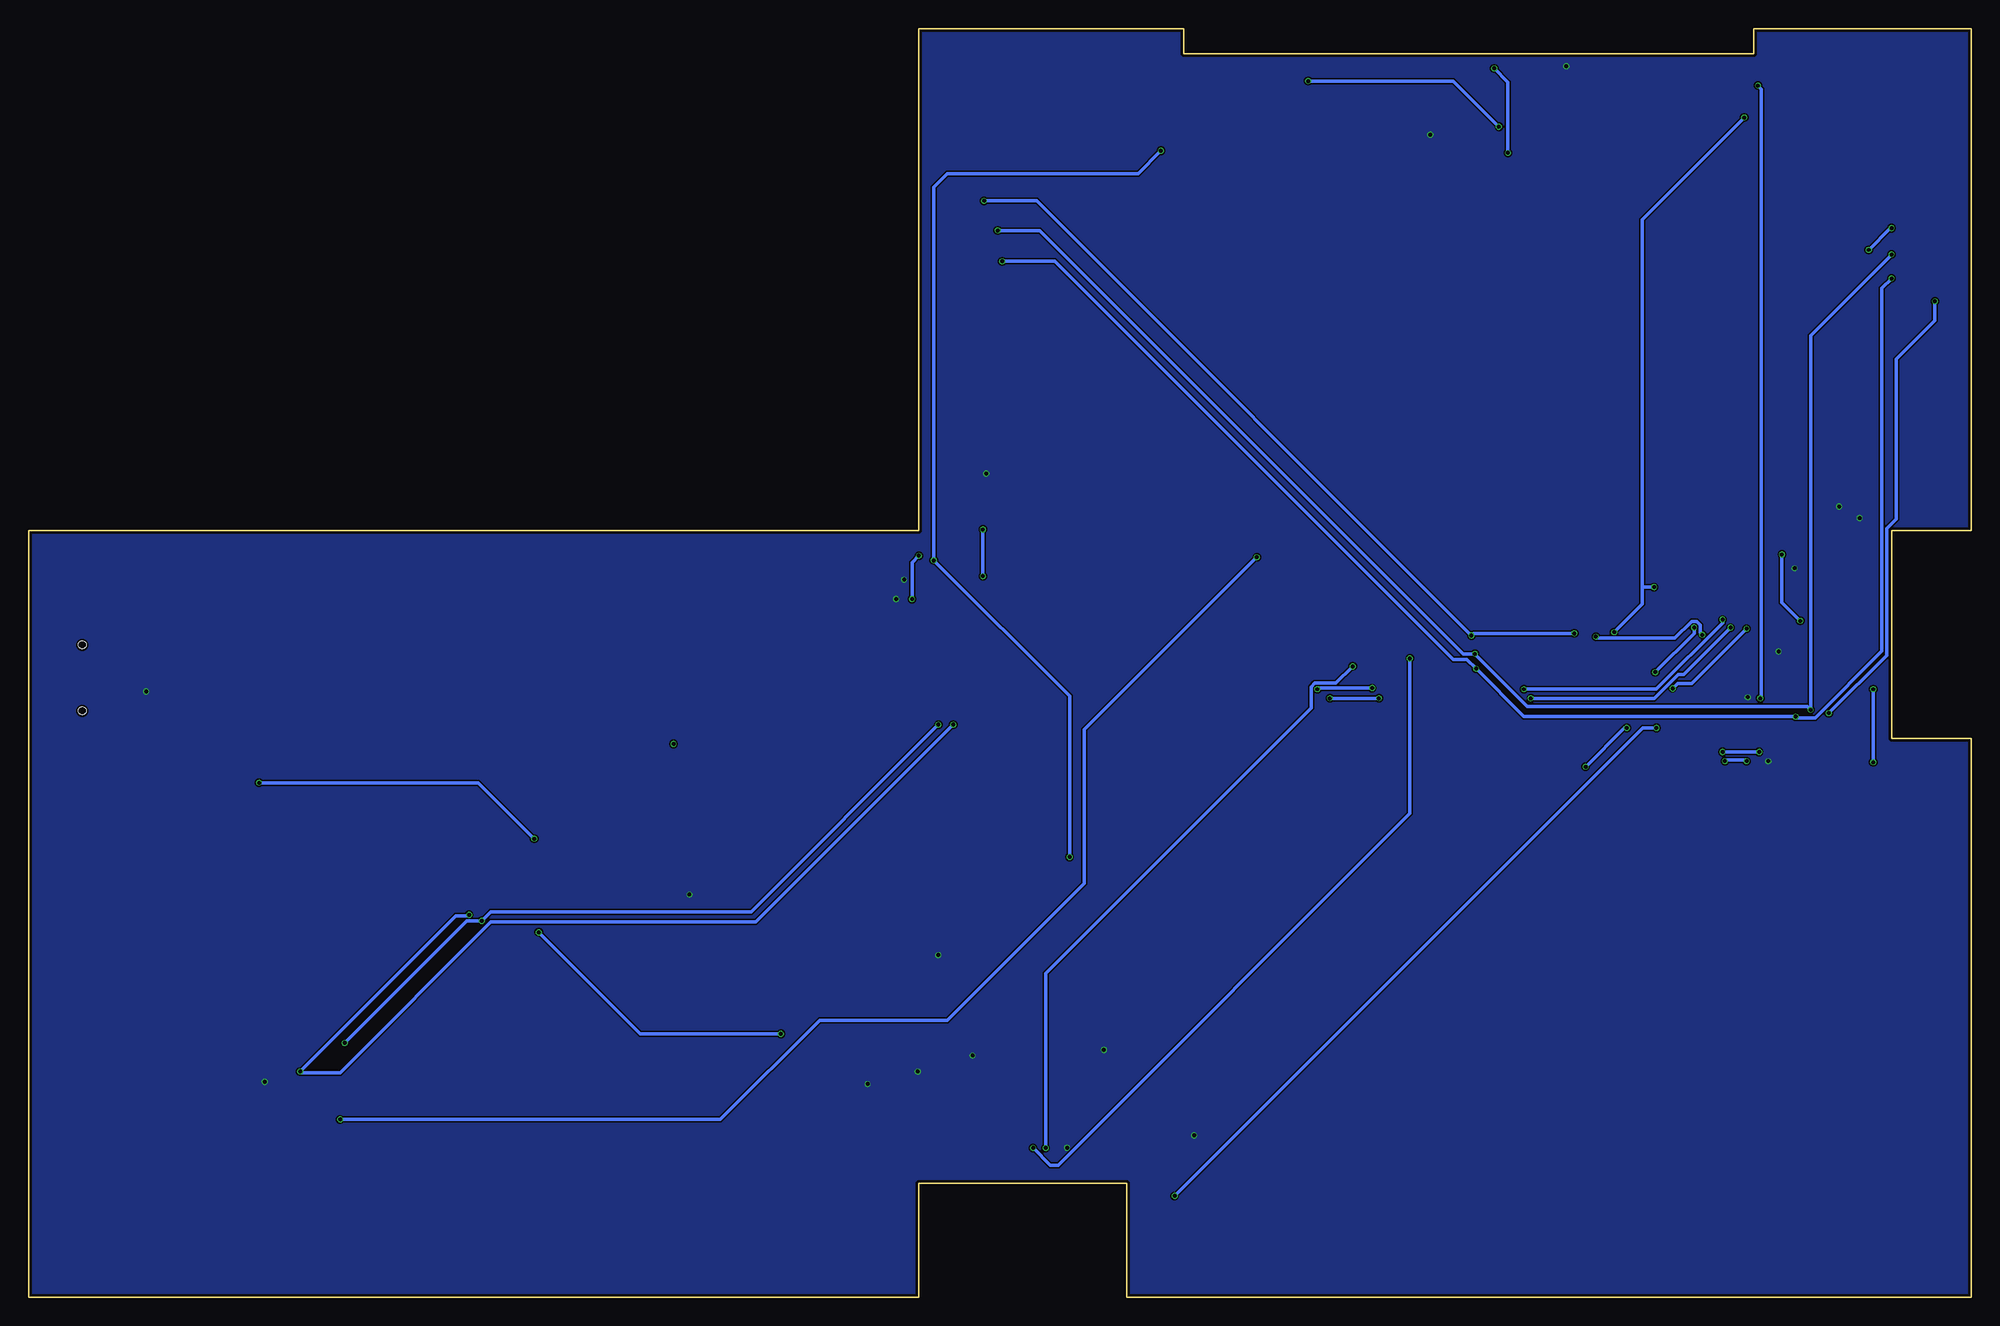
[diagram p2: board, bottom side, seen from below]

Size 170.2 x 111.2 mm. Coordinates in mm from the lower left corner, seen from the top.
Outline: 3.81,0 0,0
Outline: 0,0 0,49 7,49 7,67.2 0,67.2 0,111.2 19.05,111.2 19.05,109 69,109 69,111.2 92.2,111.2 92.2,67.2 170.2,67.2 170.2,0 92.2,0 92.2,10 74,10 74,0 0,0
Copper layers (1*16): Top 0.035mm / dielectric 1.6mm / Bottom 0.035mm
Design rules "jlcpcb-2layers.dru": minimum track width 5mil, minimum drill 0.3mm, track to track 5mil, track to pad 5mil, pad to pad 5mil, via to via 5mil, smd to smd 5mil, copper to edge 0.2mm, drill to drill 6mil, minimum pad ring 10mil, minimum via ring 3mil, stop-mask expansion 4mil, vias tented up to drill 0mil, thermal gap 10mil

### Footprints (pad centres in the part's own frame; a part is rotated, then mirrored left to right if it is on the bottom)
TP20R = smd 2 x 2: TP 0,0
MYBUTTON = smd 1.4 x 1.05: 1 1.75,0.75; 2 -1.75,0.75; 3 -1.75,-0.75; 4 1.75,-0.75
ESP32_WROVER_EAGLE-LTSPICE_C0402 = smd 0.7 x 0.9: 1 -0.65,0; 2 0.65,0
EAGLE-LTSPICE_C0402 = smd 0.7 x 0.9: 1 -0.65,0; 2 0.65,0
RCL_CT3528 = smd 2 x 2.2: + -1.5,0; - 1.5,0
CAPCP3225X100N = smd 1.4 x 1.4: 1 -1.1,0; 2 1.1,0
ADAFRUIT_CHIP-LED0603 = smd 0.8 x 0.8: A 0,-0.75; C 0,0.75
SOT95P280X145-6N = smd 1.2 x 0.6: 1 -1.25,0.95; 2 -1.25,0; 3 -1.25,-0.95; 4 1.25,-0.95; 5 1.25,0; 6 1.25,0.95
ESP32_WROVER_AVX---SD0805S020S1R0_AVX_SD0805S020S1R0_0 = smd 0.8 x 0.9: 1 -1.05,0; 2 1.05,0
SOD3716X135N = smd 1.15 x 0.8: 1 -1.75,0; 2 1.75,0
DIOC1608X36N = smd 0.97 x 0.94: 1 -0.75,0; 2 0.75,0
SOT95P280X120-5N = smd 0.9 x 0.6: 1 -1.4,0.95; 2 -1.4,0; 3 -1.4,-0.95; 4 1.4,-0.95; 5 1.4,0.95
SOT95P280X125-5N = smd 0.9 x 0.6: 1 -1.4,0.95; 2 -1.4,0; 3 -1.4,-0.95; 4 1.4,-0.95; 5 1.4,0.95
SAMACSYS_PARTS_USB4110GFA = smd 0.3 x 1.15: A1 -3.35,3.678; A4 -2.55,3.678; A5 -1.25,3.678; A6 -0.25,3.678; A7 0.25,3.678; A8 1.25,3.678; A9 2.55,3.678; A12 3.35,3.678; B1 3.05,3.678; B4 2.25,3.678; B5 1.75,3.678; B6 0.75,3.678; B7 -0.75,3.678; B8 -1.75,3.678; B9 -2.25,3.678; B12 -3.05,3.678 | smd 2.18 x 2: MP1 -5.11,-0.827; MP2 5.11,-0.827; MP3 -5.11,3.103; MP4 5.11,3.103 | hole 0.65: -2.89,2.603; 2.89,2.603
112ATAARR03ATTEND = smd 1.8 x 1.2: G1 10.6,10.4; G2 4.9,10.4; S1 7.75,10.4; S2 2.05,10.4 | smd 1.4 x 1.9: G3 13.6,-3.85; G4 0.45,-2.85 | smd 0.7 x 1.5: P1 8.8,0; P2 7.7,0.4; P3 6.6,0; P4 5.5,-0.2; P5 4.4,0; P6 3.3,-0.2; P7 2.2,0; P8 1.1,0
FH34SRJ24S05SH99 = smd 0.3 x 0.8: 1 5.75,1.45; 2 5.25,1.45; 3 4.75,1.45; 4 4.25,1.45; 5 3.75,1.45; 6 3.25,1.45; 7 2.75,1.45; 8 2.25,1.45; 9 1.75,1.45; 10 1.25,1.45; 11 0.75,1.45; 12 0.25,1.45; 13 -0.25,1.45; 14 -0.75,1.45; 15 -1.25,1.45; 16 -1.75,1.45; 17 -2.25,1.45; 18 -2.75,1.45; 19 -3.25,1.45; 20 -3.75,1.45; 21 -4.25,1.45; 22 -4.75,1.45; 23 -5.25,1.45; 24 -5.75,1.45 | smd 0.4 x 0.8: MP1 6.75,-1.05; MP2 -6.75,-1.05
JST04_1MM_RA = smd 0.6 x 1.35: 1 -1.5,0; 2 -0.5,0; 3 0.5,0; 4 1.5,0 | smd 1.2 x 2: NC1 2.8,-3.675; NC2 -2.8,-3.675
IND_4828-WE-TPC_WRE = smd 1 x 5.3: 1 -2.255,0; 2 2.26,0
ESP32C6_VARISTOR_CT/CN1812 = smd 1.5 x 3.6: 1 -2.25,0; 2 2.25,0
ESP32_WROVER_SPARKFUN-DISCRETESEMI_SOT23-3 = smd 0.8 x 0.9: 1 -0.95,-1; 2 0.95,-1; 3 0,1.1
SOT65P210X110-3N = smd 1.05 x 0.5: 1 -1.05,0.65; 2 -1.05,-0.65; 3 1.05,0
ESP32_WROVER_EAGLE-LTSPICE_R0402 = smd 0.7 x 0.9: 1 -0.65,0; 2 0.65,0
SJ = smd 1.168 x 1.6: 1 -0.762,0; 2 0.762,0
ESP32_WROVER_BME680_PSON80P300X300X100-8N = smd 1.016 x 0.5: 1 1.458,1.2; 2 1.458,0.4; 3 1.458,-0.4; 4 1.458,-1.2; 5 -1.458,-1.22; 6 -1.458,-0.4; 7 -1.458,0.4; 8 -1.458,1.2
ESP32_WROVER_SPARKFUN-IC-POWER_SOT23-5 = smd 0.55 x 1.2: 1 -0.95,-1.3; 2 0,-1.3; 3 0.95,-1.3; 4 0.95,1.3; 5 -0.95,1.3
XCVR_ESP32-C6-WROOM-1-N8 = smd 1.5 x 0.9: 1 -8.75,5.26; 2 -8.75,3.99; 3 -8.75,2.72; 4 -8.75,1.45; 5 -8.75,0.18; 6 -8.75,-1.09; 7 -8.75,-2.36; 8 -8.75,-3.63; 9 -8.75,-4.9; 10 -8.75,-6.17; 11 -8.75,-7.44; 12 -8.75,-8.71; 13 -8.75,-9.98; 14 -8.75,-11.25; 15 8.75,-11.25; 16 8.75,-9.98; 17 8.75,-8.71; 18 8.75,-7.44; 19 8.75,-6.17; 20 8.75,-4.9; 21 8.75,-3.63; 22 8.75,-2.36; 23 8.75,-1.09; 24 8.75,0.18; 25 8.75,1.45; 26 8.75,2.72; 27 8.75,3.99; 28 8.75,5.26 | smd 0.8 x 0.8: 29_1 -2.755,0.79; 29_2 -1.505,0.79; 29_3 -0.255,0.79; 29_4 -2.755,-0.46; 29_5 -1.505,-0.46; 29_6 -0.255,-0.46; 29_7 -2.755,-1.71; 29_8 -1.505,-1.71; 29_9 -0.255,-1.71
SON50P200X200X80-9N = smd 0.76 x 0.27: 1 -0.985,0.75; 2 -0.985,0.25; 3 -0.985,-0.25; 4 -0.985,-0.75; 5 0.985,-0.75; 6 0.985,-0.25; 7 0.985,0.25; 8 0.985,0.75 | smd 0.9 x 1.3: 9 0,0
SOIC127P1032X265-16N = smd 2.05 x 0.59: 1 -4.655,4.445; 2 -4.655,3.175; 3 -4.655,1.905; 4 -4.655,0.635; 5 -4.655,-0.635; 6 -4.655,-1.905; 7 -4.655,-3.175; 8 -4.655,-4.445; 9 4.655,-4.445; 10 4.655,-3.175; 11 4.655,-1.905; 12 4.655,-0.635; 13 4.655,0.635; 14 4.655,1.905; 15 4.655,3.175; 16 4.655,4.445
SON127P600X800X80-9N = smd 0.94 x 0.44: 1 -3.895,1.905; 2 -3.895,0.635; 3 -3.895,-0.635; 4 -3.895,-1.905; 5 3.895,-1.905; 6 3.895,-0.635; 7 3.895,0.635; 8 3.895,1.905 | smd 3.4 x 4.3: 9 0,0

### Placement (x,y rotation side)
3V3-PAD  81.1,100.5 0 top
BOOT_BTN  49,107.45 180 top
C1  154.26,46.04 270 top
C1_BAT  117,49 270 top
C1_BAT1  108,37.1 180 top
C1_BAT2  110.8,33.7 180 top
C2  151.86,45.86 270 top
C2_BAT  120,47 90 top
C3  122,35 90 top
C4  6,99 270 top
C5  92.9,30 180 top
C6  88.4,29.6 180 top
C7  146,14 180 top
C8  146,12 180 top
C9  93,53 270 top
C10  28,106 270 top
C11  53,106 270 top
C12  68,106 270 top
C13_SUPERCAP  96,53 270 top
C_DELAY  54,100 270 top
CHG_LED  110,48.9 90 top
D1  157.21,52.06 180 top
D2  112.6,38.2 90 top
D3  90,36 0 top
D4  90,32 180 top
D5  89.1,25 0 top
D6  94.2,58.2 0 top
D7  46.9,58.3 270 top
D8  55,57.6 270 top
D9  50.8,57.6 270 top
D10  38,62 90 top
D11  72,15 0 top
D12  13,99 270 top
EPD_3V3-PAD  85.4,21.9 0 top
EPD_3V3_C-PAD  73,33.6 0 top
EPD_BUSY-PAD  71.9,4.6 0 top
EPD_C1  91,13 90 top
EPD_C2  89.2,18 270 top
EPD_C5  87.5,18 90 top
EPD_C6  85.7,18 90 top
EPD_C7  84,18 90 top
EPD_C8  82.3,18 90 top
EPD_C9  80.67,18 90 top
EPD_C10  79,18 90 top
EPD_C11  77,18 90 top
EPD_C12  75,13 270 top
EPD_CS-PAD  68.8,18.9 0 top
EPD_DC-PAD  62.9,12.5 0 top
EPD_RST-PAD  67,8 0 top
GND  125.9,62.1 0 top
GND_AUX  81.1,104.4 0 top
IC1  115.9,34.6 180 top
IC2  51,100 0 top
J1  168.1,54.3 90 top
J2  5.08,95.9 270 top
J3  83,13 0 top
J4  165,19.3 90 top
L1  82,35 270 top
MISO  88.7,96.3 0 top
MOSI  88.7,90.9 0 top
PFMF.050.1  158.17,46.01 180 top
Q1  125.9,39.3 270 top
Q2  101.5,21.9 90 top
Q3  77.05,31.68 270 top
R1  96.3,16.4 90 top
R1_BAT  110.2,44.7 0 top
R1_PINH  149,15 270 top
R1_PINH1  95.2,60.2 0 top
R1_PWRUSB  121.85,40.8 270 top
R2  97.3,20.8 180 top
R2-USB  160.74,56.68 90 top
R2-USB1  161.03,49.98 90 top
R2_BAT  110.1,47 0 top
R2_PINH  146.3,21.2 180 top
R2_PINH1  95.2,62.2 0 top
R3  27.8,60.2 90 top
R4  147.04,46.26 180 top
R5  20,106 270 top
R6  45,106 270 top
R7  59.97,106 270 top
R8  45,59 90 top
R9  53.05,59 90 top
R10  48.7,59 90 top
R11  36,62 270 top
R12  72.6,17.6 90 top
R13  9,100 90 top
R_CAPACITOR  94,56.26 0 top
R_CHANGE  64,107.45 180 top
R_CL1  77,35 0 top
RESET_BTN  24,107.45 180 top
RTC-PAD  18.5,45 0 top
SCK  88.7,93.5 0 top
SJ1  146.95,43.33 180 top
TP1  11.4,75.1 0 top
TP2  11.4,71.2 0 top
U1  146,17 90 top
U2  113.7,48 90 top
U3  13,58 90 top
U4  130.2,35.1 270 top
U5  86,57 270 top
U6  38,57 0 top
VBAT-PAD  129.6,62.2 0 top
VBUS-PAD  109.8,41.1 0 top

### Tracks (layer width: path | path; a pad name or v marks a point on that pad's centre or on a via)
3V3  (via drill 0.35)
  Top 0.3: R5.2 13.7,105.35 R13.2 7,100.65 C4.1 3.7,97.35 3.7,90.8 4.1,90.4 J2.P4 | R5.2 21.45,103.9 43.55,103.9 R6.2 45,103 48,100 IC2.2 50.4,100 51.2,100.8 51.2,102.6 52.1,103.5 55.7,103.5 57.7,105.5 59.82,105.5 R7.2 66.15,105.35 v71,100.5 3V3-PAD.TP | R11.2 35.5,60.85 35.5,57.6 34.27,56.37 U6.3 | R12.2 72.6,25.48 72.59,25.52 75.33,28.25 75.33,31.25 75.51,31.43 77.9,31.43 Q3.3 77.65,32.18 R_CL1.2 77.65,37.25 v79,38.6 | U3.2 9.55,49.79 9.55,50.12 12.84,53.4 20.35,53.4 R3.2 v27.8,62.25 | J4.2 165.42,19.22 165.79,19.22 165.95,19.39 165.95,21.21 165.79,21.38 162.42,21.38 152.7,31.1 124.4,31.1 C3.+ 118.29,33.5 117.86,33.07 115.08,33.07 IC1.5 114.45,33.7 C1_BAT2.1 111.34,33.7 110.61,34.43 109.17,34.43 108,35.6 108,44.45 107.2,45.25 107.2,48.4 97.4,58.2 D6.2 95.25,59.6 R1_PINH1.2 R2_PINH1.2 94.65,63.4 94.65,63.53 90.03,63.53 89.17,62.67 U5.2 89.17,62.88 v90.9,64.6 | U6.3 35.97,54.5 40.35,54.5 40.35,56.09 U6.7 U6.8 42,59.01 42,59.6 42.05,59.65 R8.2 45.75,60.4 47.95,60.4 R10.2 49.35,60.3 52.4,60.3 R9.2 | U6.3 33.23,56.37 v31.3,58.3 | v19.9,103.4 19.9,105.25 R5.2
  Bottom 0.3: v31.3,58.3 28.85,60.75 28.85,62.25 | v27.8,62.25 28.85,62.25 | 28.85,62.25 28.85,94.45 v19.9,103.4 | v71,100.5 73,98.5 89.7,98.5 90.9,97.3 v90.9,64.6 79,52.7 v79,38.6
32KHZ  (via drill 0.35)
  Top 0.3: R2_PINH1.1 90.99,62.2 U5.1 91.25,60.85 92.45,60.85 v92.8,61.2 | v92.2,65 91.5,65.7 66.3,65.7 57.8,57.2 57.8,55.8 49.83,47.83 25.62,47.83 25.17,47.37 22.23,47.37 v21.8,47.8 | v18.6,47.8 17.9,48.5 U3.9
  Bottom 0.3: v92.8,61.2 92.8,64.4 v92.2,65 | v21.8,47.8 v18.6,47.8
DN
  Top 0.3: D1.1 158.83,51.48 159.47,51.48 161.54,53.55 J1.B7 164.49,53.62 165.11,53.62 165.27,53.78 165.27,54.31 165.11,54.48 164.49,54.48 J1.A7
DP
  Top 0.3: D1.3 159.5,54.05 J1.A6 163.8,54.05 163.57,54.28 163.57,54.81 163.73,54.98 164.35,54.98 J1.B6
EPD_3V3
  Top 0.3: J3.16 J3.15 81.82,14.52 81.82,14.96 82.73,15.87 83.22,15.87 83.25,15.9 86.2,15.9 87.5,17.2 EPD_C5.1 | EPD_C5.1 88.47,18.32 88.47,19.11 90,20.64 90,28.65 C6.1 89.05,31.43 89.1,31.48 89.1,32.52 88.94,32.68 88.92,32.68 88.8,32.8 86.7,32.8 86.64,32.74 L1.2 80.45,32.74 78.72,31 76.33,31 Q3.2 | EPD_C5.1 86.43,18.42 86.43,19.11 85.4,20.14 EPD_3V3-PAD.TP
EPD_3V3_C  (via drill 0.35)
  Top 0.3: R_CL1.1 76.35,32.93 Q3.1 75.08,33.6 EPD_3V3_C-PAD.TP 46.7,33.6 v33.8,46.5 | v30.2,49.9 27.7,52.4 v27.7,54.8 | v24.3,58.7 20.44,62.56 U3.18
  Bottom 0.3: v33.8,46.5 30.4,49.9 v30.2,49.9 | v27.7,54.8 24.3,58.2 v24.3,58.7
EPD_BUSY  (via drill 0.35)
  Top 0.3: v19.7,58.6 17.5,58.6 10.28,65.82 U3.26 | J3.9 84.68,14.38 84.68,12.66 82.44,10.43 73.82,10.43 71.9,8.5 EPD_BUSY-PAD.TP 69.8,6.7 v69.8,8.9 | v27.6,49.9 26.6,50.9 26.6,52.95 v26.18,53.38
  Bottom 0.3: v69.8,8.9 28.8,49.9 v27.6,49.9 | v19.7,58.6 24.5,53.8 25.75,53.8 v26.18,53.38
EPD_CS
  Top 0.3: R12.1 72.65,15.1 D11.2 74.27,13.48 74.27,13.19 74.44,13.02 75.73,13.02 75.76,13.05 76.74,13.05 77.22,12.57 82.77,12.57 83.25,13.05 J3.12 | R12.1 50.62,16.95 20.44,47.13 U3.11 | EPD_CS-PAD.TP 70.65,18.9 R12.1
EPD_DC
  Top 0.3: J3.11 83.68,14.38 83.68,12.87 82.95,12.14 77.05,12.14 76.56,12.63 75.94,12.63 75.73,12.42 75.73,11.88 75.56,11.72 74.44,11.72 74.16,12 63.4,12 EPD_DC-PAD.TP 47.3,12.5 12.82,46.98 U3.5
EPD_RST  (via drill 0.35)
  Top 0.3: J3.10 84.18,14.38 84.18,12.77 82.26,10.85 69.85,10.85 EPD_RST-PAD.TP 46.5,8 8.6,45.9 v8.6,46.9 | v8.6,53.3 8.6,57.3 10.6,59.3 v15,59.3 | v16.6,65.1 16.6,66.72 U3.21
  Bottom 0.3: v8.6,46.9 v8.6,53.3 | v15,59.3 16.6,60.9 v16.6,65.1
FLASH_CS
  Top 0.3: D10.2 36.1,62.75 R11.1 34.1,60.76 U6.1 30.3,58.91 21.71,50.31 U3.12
GDR
  Top 0.3: J3.2 88.32,14.52 88.32,14.96 89.06,15.7 94.95,15.7 R1.2 97.05,17.05 Q2.1
GND  (via drill 0.35)
  Top 0.3: U1.7 145.6,14.25 C7.2 | U3.29_5 13.46,55.5 | 13.46,55.5 U3.29_4 U3.29_7 U3.29_8 | 12.21,56.4 U3.29_2 U3.29_3 U3.29_6 | 12.21,56.4 U3.29_1 12.46,55.5 13.46,55.5 | U3.29_5 13.37,56.4 12.21,56.4 | U3.29_6 U3.29_5 | U3.29_5 U3.29_8 | U3.29_6 U3.29_9 U3.29_8 | J1.B12 J1.A1
  other vias: 86.3,72.2 87.5,21.2 68.1,14.2 79.22,13.12 92.3,19.8 16.9,56.6 76,21.7 15.5,63.9 19.6,52.6 17.8,47 112.3,35.3 149.5,18.9 159.9,53.1 90.5,30 96.7,18.7 11.6,69.3 9.8,68.3 35.5,107.9 47.4,101.9 94.2,61.2 93.5,62.9
  pour Top: -12.92,-9.92 212.92,-9.92 212.92,137.92 -12.92,137.92
  pour Bottom: -12.92,-9.92 212.92,-9.92 212.92,137.92 -12.92,137.92
GPIO8
  Top 0.3: U3.10 19.3,49.38 19.3,51.05 R3.1
I2C_PW  (via drill 0.35)
  Top 0.3: R2_PINH.2 145.6,21.15 U1.2 145.6,17.2 | C8.1 C7.1 146.68,14.03 | 146.68,14.03 147,14.35 R1_PINH.2 | 146.68,14.03 146.68,15.27 U1.6 146.4,16.4 145.6,17.2 | 145.6,17.2 144.8,16.4 U1.8 144.74,15.6 v142.9,15.6 | U3.17 22.25,66.21 22.25,65.84 23.2,64.9 62.57,64.9 v62.6,64.87
  Bottom 0.3: v142.9,15.6 109.6,15.6 100.9,24.3 89.7,24.3 77.7,36.3 77.7,49.77 v62.6,64.87
INT_RTC  (via drill 0.35)
  Top 0.3: R1_PINH1.1 88.3,60.2 87.91,60.59 U5.3 87.91,62.9 85.6,65.2 66.6,65.2 58.4,57 58.4,55.6 50.2,47.4 25.8,47.4 25.2,46.8 21.8,46.8 v21.6,47 | U3.8 16.63,46.87 RTC-PAD.TP 19.7,46.2 v19.7,47
  Bottom 0.3: v19.7,47 19.8,47.1 21.6,47.1 v21.6,47
IO/BOOT  (via drill 0.35)
  Top 0.3: C11.1 51.45,108.2 BOOT_BTN.3 BOOT_BTN.4 46.55,108.2 R6.1 43.95,107.7 v41.8,107.7 | v40.6,100.3 40.6,83.1 U3.15
  Bottom 0.3: v41.8,107.7 40.6,106.5 v40.6,100.3
IO/CHANGE  (via drill 0.35)
  Top 0.3: C12.1 66.45,108.2 R_CHANGE.3 R_CHANGE.4 61.52,108.2 R7.1 58.15,106.65 v58.1,106.6 | U3.23 14.09,75.29 v41.4,102.6
  Bottom 0.3: v41.4,102.6 45.4,106.6 v58.1,106.6
MISO  (via drill 0.35)
  Top 0.3: v7,93.7 J2.P7 | v32.9,57.9 33.16,57.63 U6.2 34.67,58.2 v34.8,58.2 | D7.2 45.8,57.55 R8.1 44.65,58 v43.8,58 | v86.5,96.1 86.7,96.3 MISO.TP | 19.92,58.07 | 19.92,58.07 v23.57,58.07 | 19.92,58.07 17.37,58.07 9.55,65.89 9.55,66.21 U3.27 v9.01,91.79 v9,91.8
  Bottom 0.3: v34.8,58.2 43.6,58.2 v43.8,58 81.9,96.1 v86.5,96.1 | v32.9,57.9 32.77,57.77 25.98,57.77 24.52,59.23 24.08,59.23 23.77,58.92 23.77,58.27 v23.57,58.07 | v9,91.8 7.1,93.7 v7,93.7
MOSI  (via drill 0.35)
  Top 0.3: v81.1,13.1 81.77,13.77 82.02,13.77 82.25,14.01 J3.14 | v7,89.3 J2.P3 | U3.7 15.36,50.86 v15.4,50.9 | U6.5 v43.4,55.09 v43.4,55.1 51.7,55.1 53.05,56.45 R9.1 54.55,56.85 D8.2 54.2,56.05 v54.2,55.3 | v84.9,90.8 88.6,90.8 MOSI.TP
  Bottom 0.3: v7,89.3 7.85,88.45 7.85,56.65 13.7,50.8 15.3,50.8 v15.4,50.9 39.2,50.9 v43.4,55.1 44.2,55.9 45.4,55.9 80.3,90.8 v84.9,90.8 | v81.1,13.1 81.1,28.4 57.83,51.67 57.83,53.52 57.52,53.83 55.67,53.83 v54.2,55.3
N$1
  Top 0.3: R2-USB1.2 163.45,53.05 J1.A5
N$2
  Top 0.3: R2-USB.1 164.4,56.03 J1.B5
N$3
  Top 0.3: IC1.1 116.93,34.02 116.73,34.02 116.5,34.26 116.5,35.3 116.75,35.55 IC1.3 | C1_BAT1.1 108.8,37.15 D2.1 115.7,37.15 IC1.3 | IC1.3 120.1,38.35 Q1.2
N$4
  Top 0.3: C5.1 93.55,30.2 D4.1 D3.2
N$5
  Top 0.3: J3.4 87.32,14.38 87.32,13.94 87.61,13.65 EPD_C1.2
N$6
  Top 0.3: J3.5 86.82,14.52 86.82,14.96 EPD_C2.2
N$7
  Top 0.3: J3.18 80.32,14.52 80.32,14.96 80.76,15.4 81.6,15.4 82.5,16.3 83.04,16.3 83.07,16.33 84.17,16.33 85.19,17.35 EPD_C6.1
N$8
  Top 0.3: J3.19 79.75,15.25 80.4,15.9 81.1,15.9 81.92,16.72 82.86,16.72 83.49,17.35 EPD_C7.1
N$9
  Top 0.3: J3.20 79.25,15.45 80.2,16.4 80.92,16.4 81.86,17.35 EPD_C8.1
N$10
  Top 0.3: R2_BAT.2 112.35,47 U2.5
N$11
  Top 0.3: J3.22 78.25,16.6 EPD_C10.1
N$12
  Top 0.3: R1_BAT.2 112.65,44.7 U2.1
N$13
  Top 0.3: EPD_C12.1 76.45,13.65 J3.24
N$14
  Top 0.3: CHG_LED.C 108.55,48.9 108,48.35 108,45.5 108.8,44.7 R1_BAT.1
N$15
  Top 0.3: C1_BAT.1 113.1,49.65 U2.4 110.8,48.95 CHG_LED.A
N$16
  Top 0.3: IC2.5 53.7,100.95 C_DELAY.1
N$17
  Top 0.3: D6.1 93.35,58 R_CAPACITOR.1
PREVGH
  Top 0.3: J3.21 78.75,15.55 80.02,16.83 80.15,16.83 EPD_C9.1 81.57,18.25 81.57,22.32 84.26,25 D5.1
PREVGL
  Top 0.3: J3.23 77.75,16.6 EPD_C11.1 78.27,18.62 78.27,21.32 88.25,31.29 D4.2
RESE
  Top 0.3: J3.3 87.82,14.52 87.82,15.07 89.25,16.5 92.35,16.5 R2.2 96.76,20.8 97.48,20.07 98.77,20.07 100.35,21.65 101.35,21.65 Q2.2
RESE'  (via drill 0.35)
  Top 0.3: R2.1 99.3,22.15 101.86,22.15 102.82,23.1 v104.3,23.1 | R4.2 146.27,46.26 145.75,45.74 145.75,43.77 SJ1.2 134.86,32 v125.5,32
  Bottom 0.3: v125.5,32 116.6,23.1 v104.3,23.1
RESET  (via drill 0.35)
  Top 0.3: IC2.1 45.73,104.82 45.73,105.81 45.52,106.02 44.44,106.02 43.81,106.65 C10.1 26.45,108.2 RESET_BTN.3 RESET_BTN.4 21.55,108.2 R5.1 19.15,106.65 v18.7,106.2 | U3.3 10.28,49.88 12.9,52.5 v18.5,52.5
  Bottom 0.3: v18.7,106.2 18.4,105.9 18.4,52.6 v18.5,52.5
RTC_RST  (via drill 0.35)
  Top 0.3: U3.16 22.98,65.72 23.3,65.4 63.8,65.4 65.5,67.1 86.5,67.1 86.6,67.2 v86.6,67.3 | v86.6,63.2 86.6,61.69 U5.4
  Bottom 0.3: v86.6,67.3 v86.6,63.2
RX
  Top 0.3: TP2.TP 12.82,69.78 U3.24
SCK  (via drill 0.35)
  Top 0.3: J3.13 82.75,13.65 v82.2,13.1 | J2.P5 5.18,91.4 v7,91.4 | U3.6 v14.09,51.49 v14.1,51.5 | U6.6 43.47,56.37 v43.5,56.4 48.15,56.4 48.7,56.95 R10.1 50.2,56.85 D9.2 50.05,56.85 v49.2,56 | SCK.TP v85.3,93.5
  Bottom 0.3: v7,91.4 14.1,84.3 v14.1,51.5 14.4,51.8 38.9,51.8 v43.5,56.4 44.5,56.4 81.6,93.5 v85.3,93.5 | v82.2,13.1 80.7,11.6 80,11.6 49.2,42.4 v49.2,56
SCL  (via drill 0.35)
  Top 0.3: U1.4 147.2,20.95 R2_PINH.1 | J4.4 147.35,20.8 R2_PINH.1 | U4.7 130.45,33.05 v130.5,33 | v142.5,22.3 145.85,22.3 R2_PINH.1 | U5.16 90.5,52.29 v90.5,50.2 90.5,49.8 89.7,49 81.9,49 78.4,52.5 v56.2,52.5 | U3.20 17.9,61.4 20.6,58.7 v21.1,58.7 | v38.6,52.5 v51.9,52.5
  Bottom 0.3: v142.5,22.3 131.8,33 v130.5,33 129.7,33.8 106.9,33.8 v90.5,50.2 | v21.1,58.7 25.2,54.6 25.7,54.6 27.8,52.5 v38.6,52.5 | v51.9,52.5 v56.2,52.5
SDA  (via drill 0.35)
  Top 0.3: J4.3 153.15,19.8 R1_PINH.1 148.45,15.65 146.5,17.6 146.5,18.36 U1.3 v146.4,19.8 | v131.6,33.53 131.54,33.53 U4.8 | U5.15 89.17,50.23 | 89.17,50.23 v89.2,50.2 | U3.19 19.17,62.03 v21.8,59.4 | v39.2,53.3 52.4,53.3 v52.5,53.4 | v57.3,53.3 78.6,53.3 82.3,49.6 88.55,49.6 89.17,50.23
  Bottom 0.3: v131.6,33.53 131.7,33.43 132.77,33.43 v146.4,19.8 146.3,19.7 142.9,19.7 129.7,32.9 106.5,32.9 v89.2,50.2 | v21.8,59.4 21.8,59.1 27.6,53.3 v39.2,53.3 | v52.5,53.4 57.2,53.4 v57.3,53.3
SRC
  Top 0.3: C5.2 99.3,22.95 Q2.3 | C5.2 84.96,37.29 L1.1 | D5.2 90.85,28.6 C5.2
SS_SD  (via drill 0.35)
  Top 0.3: D12.2 10.1,98.25 R13.1 8.1,98.45 8.1,88.8 7.5,88.2 J2.P2 4.1,88.2 v3.2,87.3 | U3.4 11.55,50.25 v12.5,51.2
  Bottom 0.3: v3.2,87.3 3.2,85.6 6.57,82.23 6.57,68.23 7.43,67.38 7.43,56.27 v12.5,51.2
TX
  Top 0.3: U3.25 11.4,66.9 11.4,67.79 9.62,69.57 9.62,73.53 11.09,75 11.3,75 TP1.TP
USB_D+
  Top 0.3: D1.4 154.3,54.67 154.3,66.1 153.77,66.63 65.63,66.63 56.6,57.6 56.6,56.3 49.05,48.75 24.75,48.75 U3.14
USB_D-
  Top 0.3: U3.13 22.98,48.02 23.2,47.8 24.8,47.8 25.3,48.3 49.4,48.3 57.2,56.1 57.2,57.4 66,66.2 153.3,66.2 153.8,65.7 153.8,52.6 155.29,51.11 D1.6
VBAT  (via drill 0.35)
  Top 0.3: Q1.3 129.1,37.2 129.8,37.2 129.95,37.05 129.95,36.3 | 129.95,36.3 U4.3 | U4.2 130.16,36.09 129.95,36.3 | v113.7,48.5 114.23,48.5 114.28,48.55 114.6,48.55 U2.3 115.4,48.55 115.72,48.55 115.88,48.39 115.88,48.28 117.88,46.27 120.08,46.27 C2_BAT.1 124.35,42 126.6,42 127,41.6 Q1.3 | Q1.3 129.3,41.6 129.3,61.9 VBAT-PAD.TP
VBUS  (via drill 0.35)
  Top 0.3: D1.2 157.56,52.06 157.3,51.8 157.3,50.2 155.92,48.82 PFMF.050.1.2 C1.1 154.08,46.51 C2.1 151.41,46.51 v150,45.1 | v125.9,40.2 125.85,40.25 Q1.1 124.8,40.15 R1_PWRUSB.2 119.35,40.15 118.45,39.25 D2.2 110.75,41.1 VBUS-PAD.TP
  Bottom 0.3: v125.9,40.2 130.8,45.1 v150,45.1
VRTC
  Top 0.3: R_CAPACITOR.2 96,54.91 C13_SUPERCAP.1 93.45,54.1 C9.1 88.55,53.65 87.91,53.01 U5.14
VUSB
  Top 0.3: PFMF.050.1.1 163,48.59 163,50.95 163.73,51.68 164.35,51.68 J1.A4 J1.B9 164.49,52.12 165.11,52.12 165.7,52.71 165.7,55.89 165.11,56.48 164.49,56.48 J1.B4 J1.A9